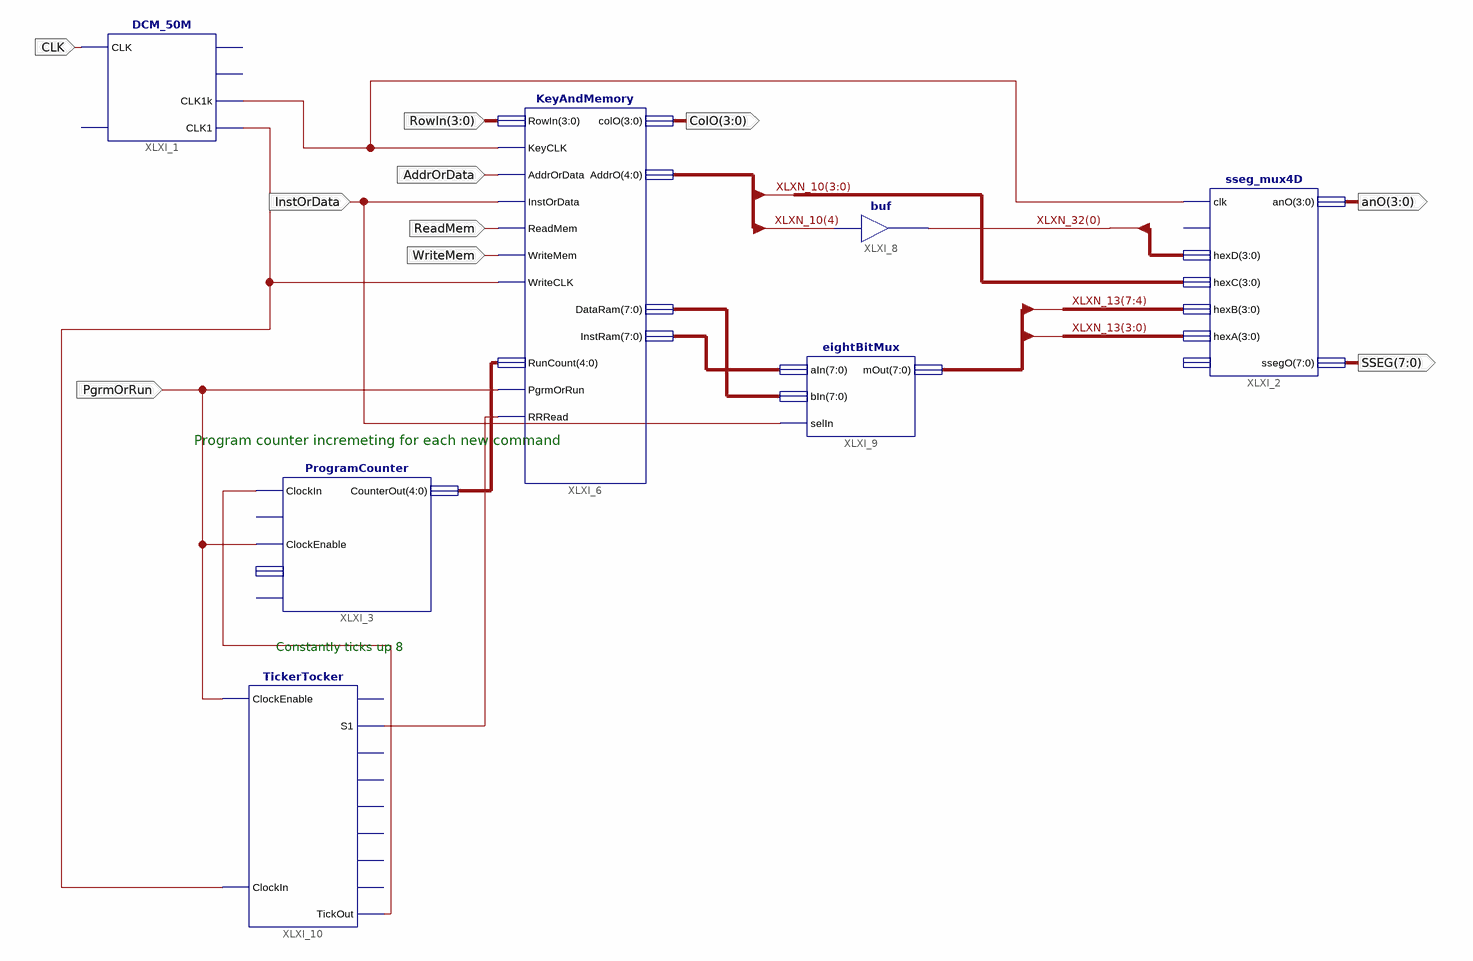
[diagram p0: schematic sheet 1]
// Xilinx ISE schematic TestArea.sch (spartan3e) as structural Verilog: 7 symbols, 10 ports
module TestArea (
  input  CLK,
  input  AddrOrData,
  input  ReadMem,
  input  WriteMem,
  input  [3:0] RowIn,
  input  InstOrData,
  input  PgrmOrRun,
  output [3:0] ColO,
  output [3:0] anO,
  output [7:0] SSEG
);

  wire XLXN_1, XLXN_60, XLXN_61, XLXN_62;
  wire [3:0] XLXN_32;
  wire [4:0] XLXN_10, XLXN_49;
  wire [7:0] XLXN_13, XLXN_36, XLXN_37;

  DCM_50M XLXI_1 (.CLK(CLK), .CLK1k(XLXN_1), .CLK1(XLXN_60));  // open: RST, CLK1M, CLK10k
  sseg_mux4D XLXI_2 (
    .clk(XLXN_1), .hexD(XLXN_32), .hexC(XLXN_10[3:0]), .hexB(XLXN_13[7:4]), .hexA(XLXN_13[3:0]), .anO(anO),
    .ssegO(SSEG));  // open: rb_in, dp_in
  KeyAndMemory XLXI_6 (
    .RowIn(RowIn), .KeyCLK(XLXN_1), .AddrOrData(AddrOrData), .RunCount(XLXN_49), .PgrmOrRun(PgrmOrRun),
    .ReadMem(ReadMem), .InstOrData(InstOrData), .WriteCLK(XLXN_60), .WriteMem(WriteMem), .RRRead(XLXN_62),
    .colO(ColO), .DataRam(XLXN_36), .InstRam(XLXN_37), .AddrO(XLXN_10));
  buf XLXI_8 (XLXN_32[0], XLXN_10[4]);
  eightBitMux XLXI_9 (.aIn(XLXN_37), .bIn(XLXN_36), .selIn(InstOrData), .mOut(XLXN_13));
  ProgramCounter XLXI_3 (
    .ClockIn(XLXN_61), .ClockEnable(PgrmOrRun), .CounterOut(XLXN_49));  // open: ClearIn, CountLoad, PushLoad
  TickerTocker XLXI_10 (
    .ClockEnable(PgrmOrRun), .ClockIn(XLXN_60), .S1(XLXN_62), .TickOut(XLXN_61));  // open: S0, S2, S3, S4, S5, S6, S7

  // Notes on the sheet:
  //   Program counter incremeting for each new command
  //   Constantly ticks up 8
endmodule
